# EAGLE design Sensor Board (EAGLE 5.10)
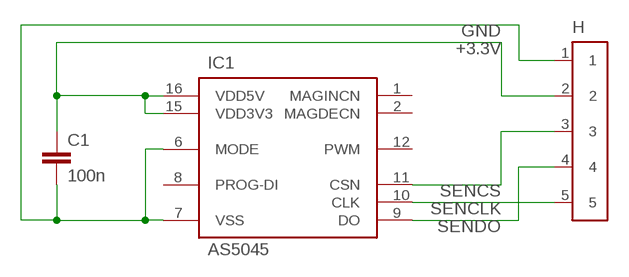
[diagram p0: schematic, sheet 1]

## Parts
C1  100n  C-EUC0402  [C0402]
H  HEADER-M52  [HEADER-M52]
IC1  AS5045  [SSOP16]

## Nets
+3.3V [power]: C1.1 H.2 IC1.15(VDD3V3) IC1.16(VDD5V)
GND [gnd]: C1.2 H.1 IC1.6(MODE) IC1.7(VSS)
SENCLK: H.5 IC1.10(CLK)
SENCS: H.3 IC1.11(CSN)
SENDO: H.4 IC1.9(DO)
Unconnected: IC1.1(MAGINCN) IC1.2(MAGDECN) IC1.8(PROG-DI) IC1.12(PWM)

## Library data of the parts
C1 = rcl:C-EU: CAPACITOR, European symbol
H = sim:HEADER-M52: HEADER M52
IC1 = sim:AS5045: ANGULAR ENCODER AS5045

## Net classes
0 default: width 0.203 mm, drill 0.305 mm, clearance 0.152 mm
1 power: width 0.203 mm, drill 0.305 mm, clearance 0.152 mm
2 gnd: width 0.203 mm, drill 0.305 mm, clearance 0.152 mm

## Board
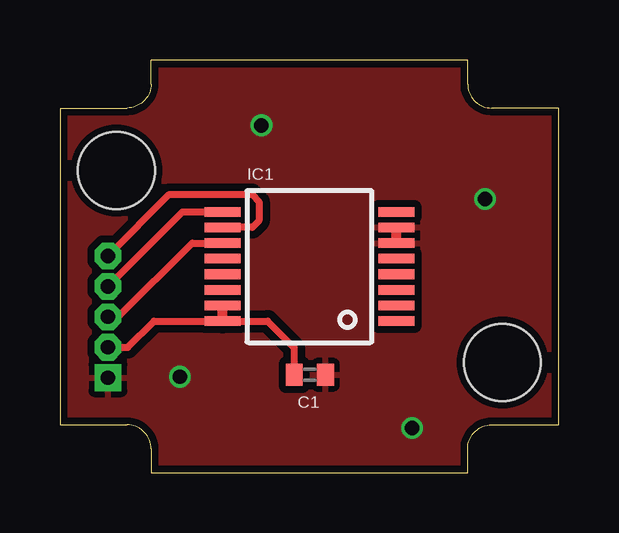
[diagram p1: board, top side]
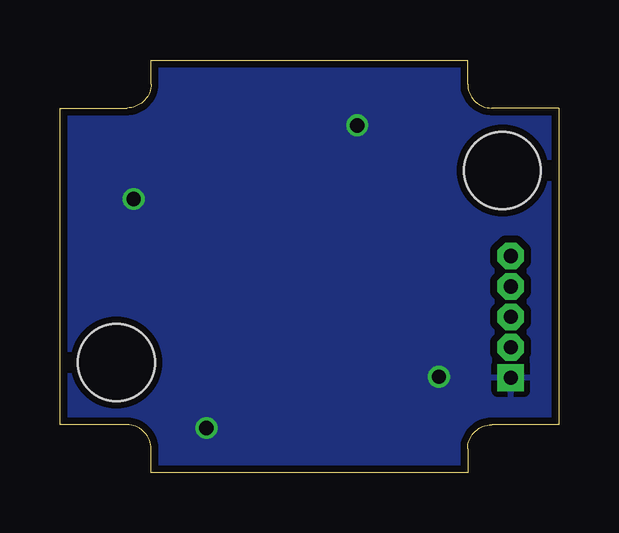
[diagram p2: board, bottom side, seen from below]

Size 20.8 x 17.2 mm. Coordinates in mm from the lower left corner, seen from the top.
Outline: 3.8,0 17,0 17,1 arc-90 18,2 20.8,2 20.8,15.2 18,15.2 arc-90 17,16.2 17,17.2 3.8,17.2 3.8,16.2 arc-90 2.8,15.2 0,15.2 0,2 2.8,2 arc-90 3.8,1 3.8,0
Copper layers (1*16): Top 0.035mm / dielectric 1.5mm / Bottom 0.035mm
Design rules "default *": minimum track width 6mil, minimum drill 12mil, track to track 6mil, track to pad 6mil, pad to pad 6mil, via to via 6mil, smd to smd 6mil, copper to edge 4mil, drill to drill 4mil, minimum pad ring 10mil, minimum via ring 6mil, stop-mask expansion 4mil, vias tented up to drill 0mil, thermal gap 10mil
Holes 3.2 mm at 2.35,12.6 18.45,4.6

### Footprints (pad centres in the part's own frame; a part is rotated, then mirrored left to right if it is on the bottom)
C0402 = smd 0.7 x 0.9: 1 -0.65,0; 2 0.65,0
HEADER-M52 = drill 0.6 square: 1 -2.54,0 | drill 0.6 octagon: 2 -1.27,0; 3 0,0; 4 1.27,0; 5 2.54,0
SSOP16 = smd 1.5 x 0.4: 1 3.625,-2.275; 2 3.625,-1.625; 3 3.625,-0.975; 4 3.625,-0.325; 5 3.625,0.325; 6 3.625,0.975; 7 3.625,1.625; 8 3.625,2.275; 9 -3.625,2.275; 10 -3.625,1.625; 11 -3.625,0.975; 12 -3.625,0.325; 13 -3.625,-0.325; 14 -3.625,-0.975; 15 -3.625,-1.625; 16 -3.625,-2.275

### Placement (x,y rotation side)
C1  10.42,4.09 0 top
H  2,6.5 90 top
IC1  10.4,8.6 0 top

### Tracks (layer width: path | path; a pad name or v marks a point on that pad's centre or on a via)
+3.3V
  Top 0.3: C1.1 9.77,5.22 8.66,6.33 IC1.16 3.92,6.33 2.83,5.23 H.2
  Top 0.406: IC1.15 IC1.16 6.8,6.35
GND  (via drill 0.6)
  Top 0.406: IC1.6 IC1.7
  other vias: 8.4,14.48 17.73,11.41 14.69,1.86 5,4
  pour Top (isolate 0.305): 0,2 3.8,2 3.8,0 17,0 17,2 20.8,2 20.8,15.2 17,15.2 17,17.2 3.8,17.2 3.8,15.2 0,15.2
  pour Bottom (isolate 0.305): 0,2 3.8,2 3.8,0 17,0 17,2 20.8,2 20.8,15.2 17,15.2 17,17.2 3.8,17.2 3.8,15.2 0,15.2
SENCLK
  Top 0.3: H.5 4.56,11.6 8,11.6 8.3,11.3 8.3,10.5 8.03,10.22 IC1.10
SENCS
  Top 0.3: IC1.11 5.51,9.57 2.44,6.5 H.3
SENDO
  Top 0.3: H.4 5.11,10.88 IC1.9